# Altium schematic sheet Expansion.SchDoc
size A3; SheetNumber: 12; SheetTotal: 12
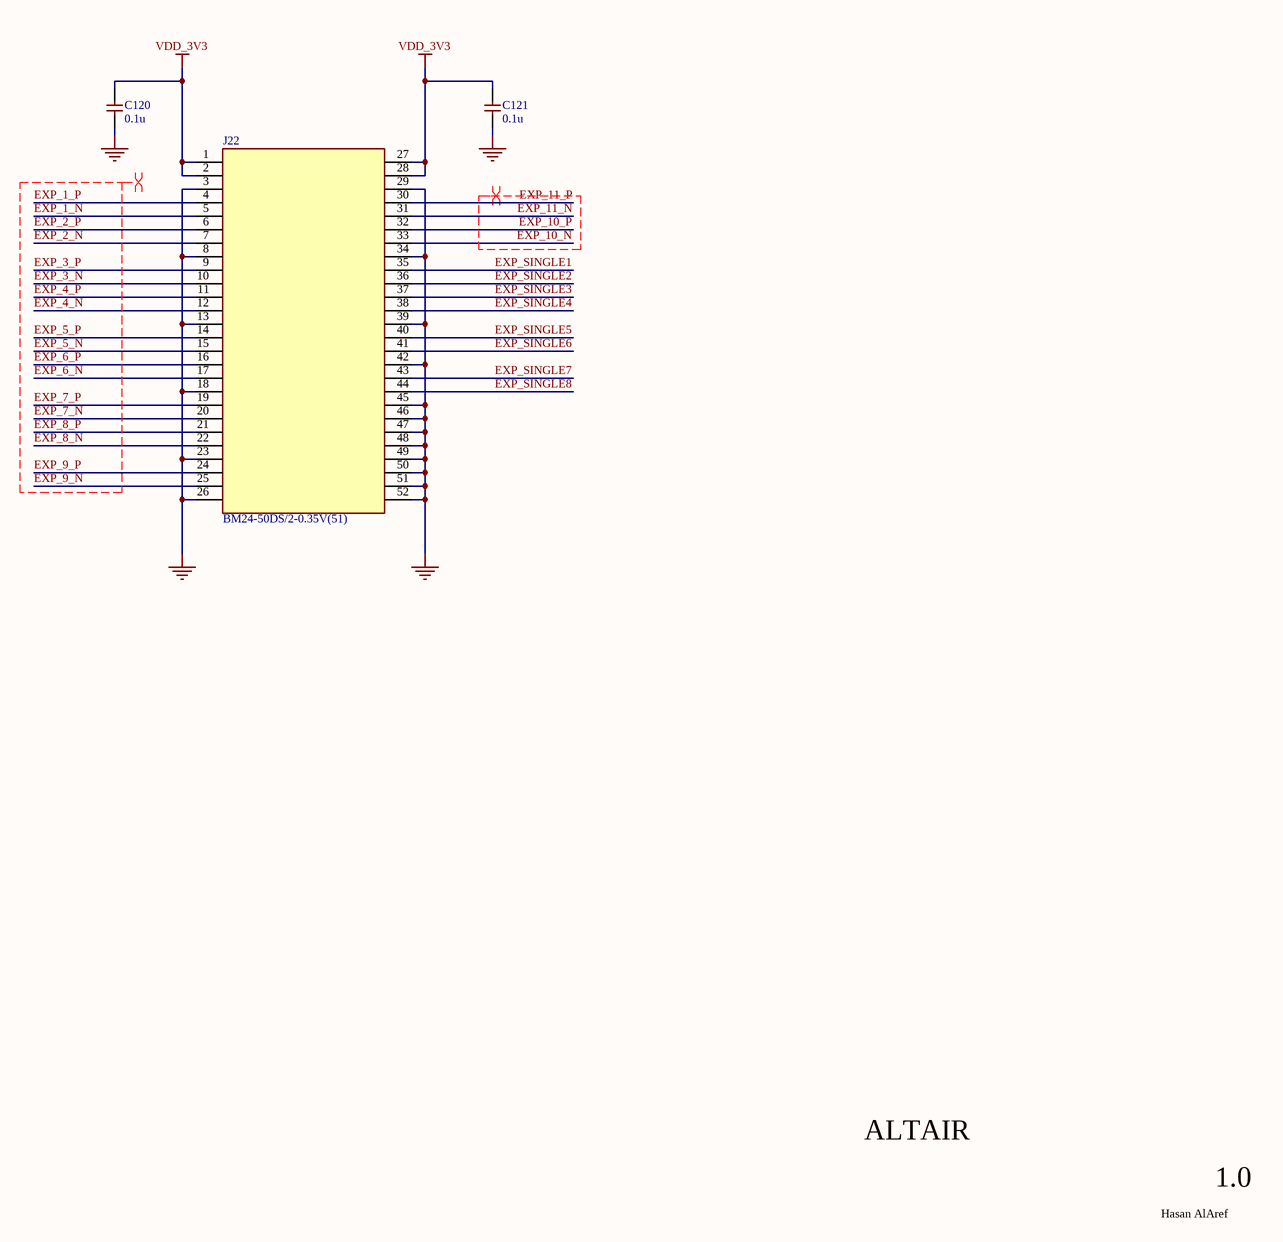
[diagram p0: Expansion.SchDoc]

## Parts
C120  0.1u  [CAP_0402]
C121  0.1u  [CAP_0402]
J22  BM24-50DS/2-0.35V(51)  [BM24-50DS/2-0.35V(51)]

## Nets
GND: C120.1 C121.1 J22.3 J22.8 J22.13 J22.18 J22.23 J22.26 J22.29 J22.34 J22.39 J22.42 J22.45 J22.46 J22.47 J22.48 J22.49 J22.50 J22.51 J22.52
VDD_3V3: C120.2 C121.2 J22.1 J22.2 J22.27 J22.28
EXP_1_N: J22.5
EXP_1_P: J22.4
EXP_2_N: J22.7
EXP_2_P: J22.6
EXP_3_N: J22.10
EXP_3_P: J22.9
EXP_4_N: J22.12
EXP_4_P: J22.11
EXP_5_N: J22.15
EXP_5_P: J22.14
EXP_6_N: J22.17
EXP_6_P: J22.16
EXP_7_N: J22.20
EXP_7_P: J22.19
EXP_8_N: J22.22
EXP_8_P: J22.21
EXP_9_N: J22.25
EXP_9_P: J22.24
EXP_10_N: J22.33
EXP_10_P: J22.32
EXP_11_N: J22.31
EXP_11_P: J22.30
EXP_SINGLE1: J22.35
EXP_SINGLE2: J22.36
EXP_SINGLE3: J22.37
EXP_SINGLE4: J22.38
EXP_SINGLE5: J22.40
EXP_SINGLE6: J22.41
EXP_SINGLE7: J22.43
EXP_SINGLE8: J22.44

## Layout directives
differential pair: EXP_1_N, EXP_1_P, EXP_2_N, EXP_2_P, EXP_3_N, EXP_3_P, EXP_4_N, EXP_4_P, EXP_5_N, EXP_5_P, EXP_6_N, EXP_6_P, EXP_7_N, EXP_7_P, EXP_8_N, EXP_8_P, EXP_9_N, EXP_9_P, EXP_10_N, EXP_10_P, EXP_11_N, EXP_11_P

## Notes on the sheet
- ALTAIR
- 1.0
- Hasan AlAref

## Library data of the parts
C120 C121 = CAP_0402: Capacitor SMD 0402; Part No: CL05B104KO5NNNC; Note/Misc: 16V, 0402; LCSC: *; JLCPCB Part #: C338112; Footprint JLCPCB: 0402
J22 = BM24-50DS/2-0.35V(51): BTB Connector; LCSC: *; Note/Misc: *; Part No: *; JLCPCB Part #: C424561; Footprint JLCPCB: SMD,P=0.35mm